# EAGLE schematic fuelboxmp3 (EAGLE 6.4)
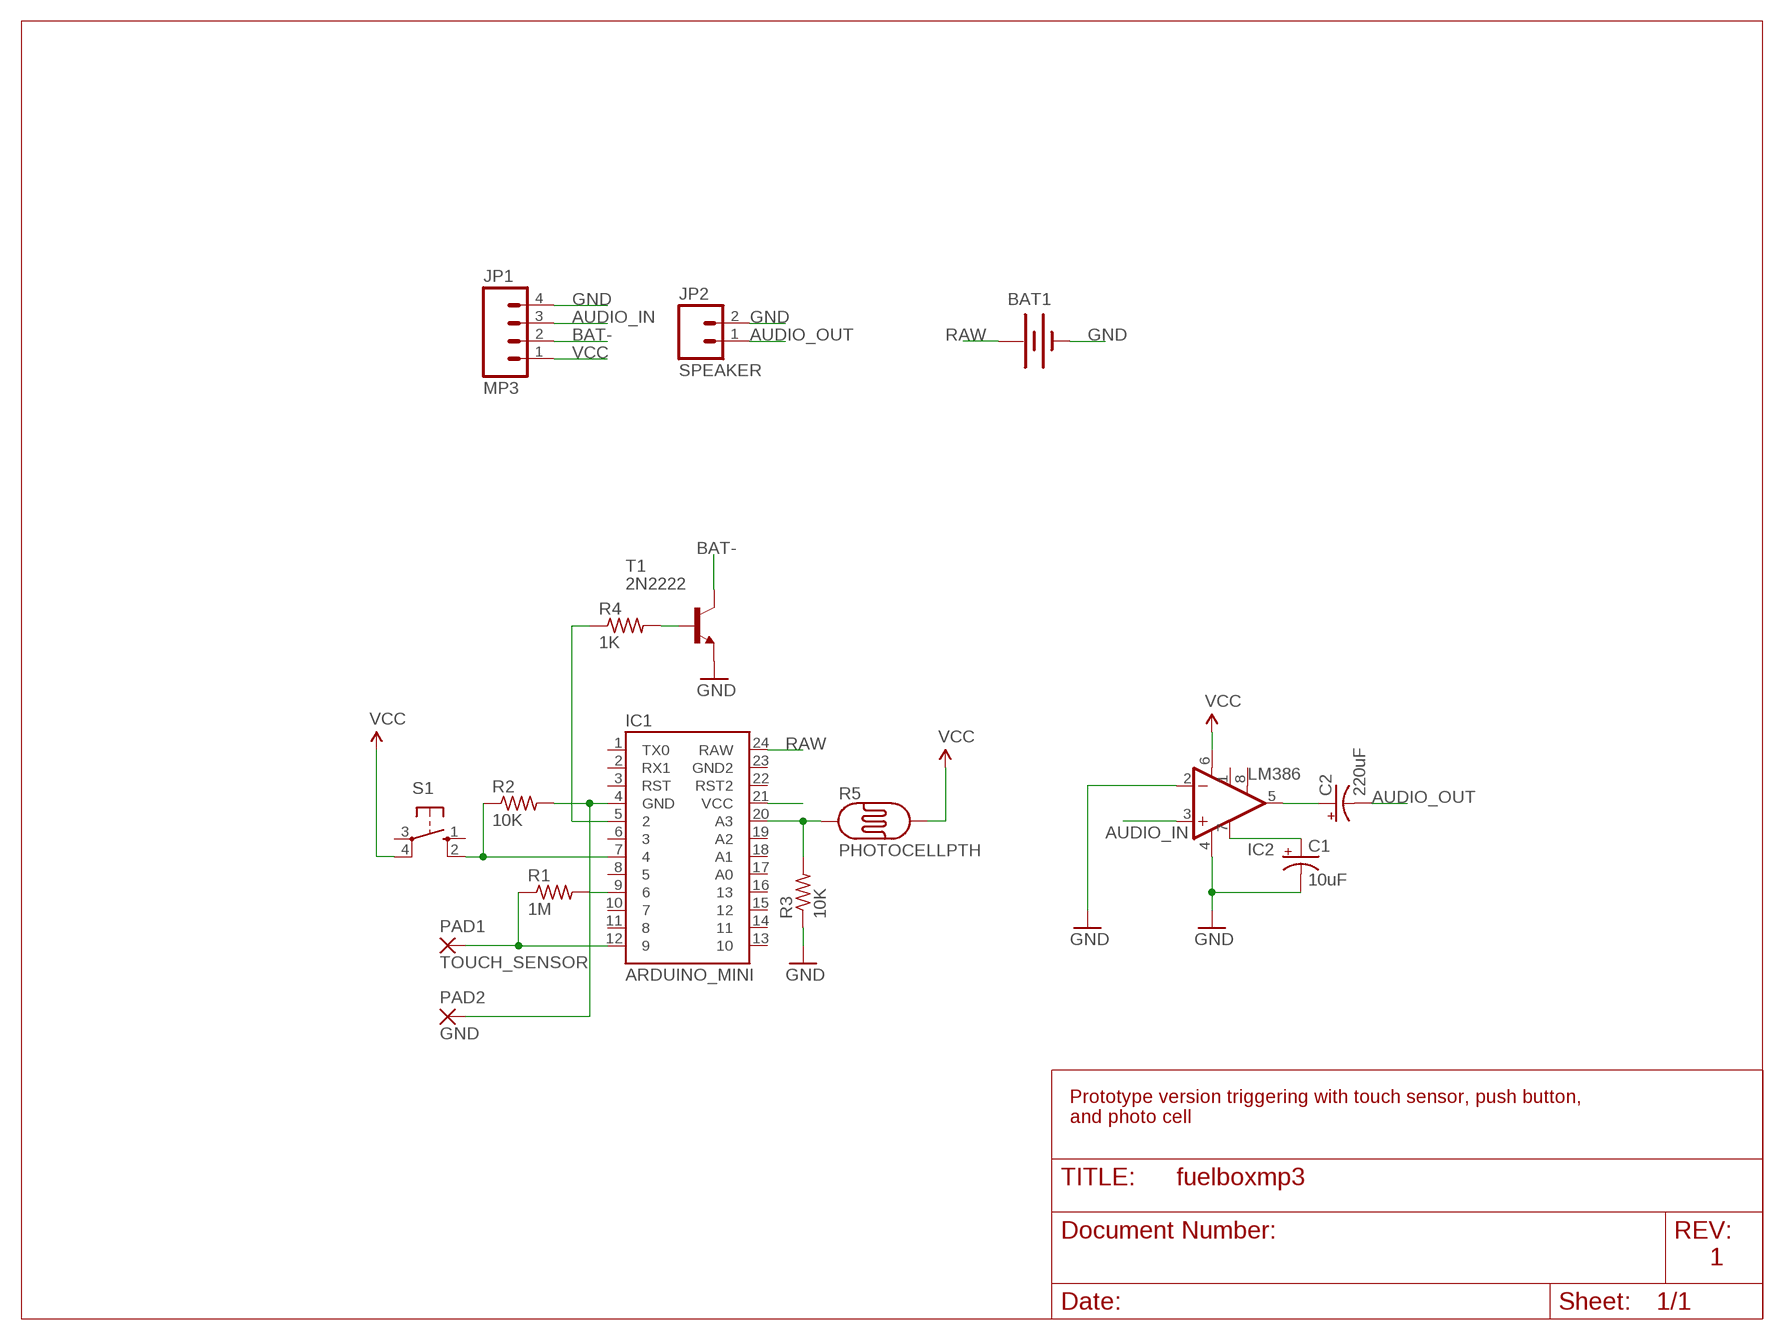
[diagram p0: schematic, sheet 1]

## Parts
BAT1  BATTERY1100  [LIPO-1100MAH]
C1  10uF  CPOL-USE2.5-5  [E2,5-5]
C2  220uF  CPOL-USE2.5-6  [E2,5-6]
IC1  ARDUINO_MINI  [ARDUINO_MINI]
IC2  LM386  [DIP08]
JP1  MP3  M04PTH  [1X04]
JP2  SPEAKER  M02PTH  [1X02]
PAD1  TOUCH_SENSOR  WIREPAD3,81/1,1  [3,81/1,1]
PAD2  GND  WIREPAD3,81/1,1  [3,81/1,1]
R1  1M  R-US_0204/7  [0204/7]
R2  10K  R-US_0204/7  [0204/7]
R3  10K  R-US_0204/7  [0204/7]
R4  1K  R-US_0204/7  [0204/7]
R5  PHOTOCELLPTH  [PHOTOCELL]
S1  10-XX  [B3F-10XX]
T1  2N2222  [TO92-EBC-OVAL]

## Nets
AUDIO_IN: IC2.3(+IN) JP1.3
AUDIO_OUT: C2.- JP2.1
BAT-: JP1.2 T1.C
GND: BAT1.- C1.- IC1.4(GND) IC2.2(-IN) IC2.4(V-) JP1.4 JP2.2 PAD2.1(P) R2.2 R3.1 T1.E
N$1: IC1.9 R1.2
N$2: IC1.12 PAD1.1(P) R1.1
N$3: C2.+ IC2.5(OUT)
N$4: IC1.7 R2.1 S1.2(S1)
N$5: IC1.20(A3) R3.2 R5.1
N$6: IC1.5 R4.1
N$7: R4.2 T1.B
N$8: C1.+ IC2.7(BP)
RAW: BAT1.+ IC1.24(RAW)
VCC: IC1.21(VCC) IC2.6(V+) JP1.1 R5.2 S1.4(P1)
Unconnected: IC1.1(TX0) IC1.2(RX1) IC1.3(RST) IC1.6 IC1.8 IC1.10 IC1.11 IC1.13 IC1.14 IC1.15 IC1.16 IC1.17(A0) IC1.18(A1) IC1.19(A2) IC1.22(RST2) IC1.23(GND2) IC2.1(GAIN) IC2.8(GAIN) S1.1(S) S1.3(P)

## Notes on the sheet
- Prototype version triggering with touch sensor, push button, 
  and photo cell
- 1

## Library data of the parts
BAT1 = SparkFun-Electromechanical:BATTERY: Battery Holders Various common sizes : AA, AAA, 20mm coin cell and 12mm coin cell. 20MM_4LEGS, BATT-10373
C1 C2 = rcl:CPOL-US: POLARIZED CAPACITOR, American symbol
IC1 = SparkFun-Boards:ARDUINO_MINI: Arduino Pro Mini footprint
IC2 = SparkFun-AnalogIC:LM386: low voltage audio power amplifier
JP1 = SparkFun-Connectors:M04: Header 4 Standard 4-pin 0.1" header. Use with straight break away headers (SKU : PRT-00116), right angle break away headers (PRT-00553), swiss pins (PRT-00743), machine pins (PRT-00117), and female headers (PRT-00115). Molex polarized connector foot print use with SKU : PRT-08231 with associated crimp pins and housings. 1MM SMD Version SKU: PRT-10208
JP2 = SparkFun-Connectors:M02: Standard 2-pin 0.1" header. Use with - straight break away headers ( PRT-00116) - right angle break away headers (PRT-00553) - swiss pins (PRT-00743) - machine pins (PRT-00117) - female headers (PRT-00115) Molex polarized connector foot print use with: PRT-08233 with associated crimp pins and housings. 2.54_SCREWTERM for use with PRT-10571. 3.5mm Screw Terminal footprints for PRT-08084 5mm Screw Terminal footprints for use with PRT-08433
PAD1 PAD2 = wirepad:WIREPAD: Wire PAD connect wire on PCB
R1-R4 = rcl:R-US_: RESISTOR, American symbol
R5 = SparkFun-Sensors:PHOTOCELL: CdS photoresistor. This is a low cost way to detect light levels. Resistance decreases with more incoming light. SparkFun SKU: SEN-09088
S1 = switch-omron:10-XX: OMRON SWITCH; MPN: B3F-1000; OC_FARNELL: 176432; OC_NEWARK: 36M3542
T1 = adafruit:2N2222: NPN TRANSISTOR Big oval pads